# EAGLE design auto_leg_part (EAGLE 9.2.2)
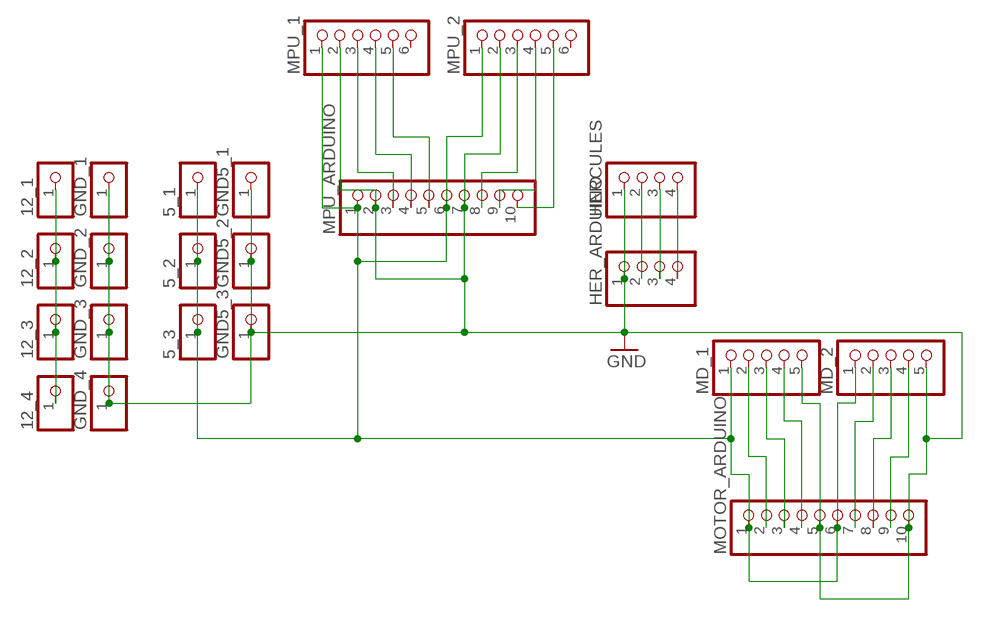
[diagram p0: schematic, sheet 1]

## Parts
5_1  PINHD-1X1  [1X01]
5_2  PINHD-1X1  [1X01]
5_3  PINHD-1X1  [1X01]
12_1  PINHD-1X1  [1X01]
12_2  PINHD-1X1  [1X01]
12_3  PINHD-1X1  [1X01]
12_4  PINHD-1X1  [1X01]
GND5_1  PINHD-1X1  [1X01]
GND5_2  PINHD-1X1  [1X01]
GND5_3  PINHD-1X1  [1X01]
GND_1  PINHD-1X1  [1X01]
GND_2  PINHD-1X1  [1X01]
GND_3  PINHD-1X1  [1X01]
GND_4  PINHD-1X1  [1X01]
HER_ARDUINO  PINHD-1X4  [1X04]
HERCULES  PINHD-1X4  [1X04]
MD_1  PINHD-1X5  [1X05]
MD_2  PINHD-1X5  [1X05]
MOTOR_ARDUINO  PINHD-1X10  [1X10]
MPU_1  PINHD-1X6  [1X06]
MPU_2  PINHD-1X6  [1X06]
MPU_ARDUINO  PINHD-1X10  [1X10]

## Nets
GND: GND5_1.1 GND5_2.1 GND5_3.1 GND_1.1 GND_2.1 GND_3.1 GND_4.1 HER_ARDUINO.1 HERCULES.1 MD_1.5 MD_2.5 MOTOR_ARDUINO.5 MOTOR_ARDUINO.10 MPU_1.2 MPU_2.2 MPU_ARDUINO.2 MPU_ARDUINO.7
N$3: 12_1.1 12_2.1 12_3.1 12_4.1
N$5: 5_1.1 5_2.1 5_3.1 MD_1.1 MD_2.1 MOTOR_ARDUINO.1 MOTOR_ARDUINO.6 MPU_1.1 MPU_2.1 MPU_ARDUINO.1 MPU_ARDUINO.6
N$7: MPU_1.3 MPU_ARDUINO.3
N$8: MPU_1.4 MPU_ARDUINO.4
N$9: MPU_1.5 MPU_ARDUINO.5
N$12: MPU_2.3 MPU_ARDUINO.8
N$13: MPU_2.4 MPU_ARDUINO.9
N$14: MPU_2.5 MPU_ARDUINO.10
N$16: MD_1.4 MOTOR_ARDUINO.4
N$17: MD_1.3 MOTOR_ARDUINO.3
N$18: MD_1.2 MOTOR_ARDUINO.2
N$21: MD_2.2 MOTOR_ARDUINO.7
N$22: MD_2.3 MOTOR_ARDUINO.8
N$23: MD_2.4 MOTOR_ARDUINO.9
N$26: HER_ARDUINO.2 HERCULES.2
N$27: HER_ARDUINO.3 HERCULES.3
N$28: HER_ARDUINO.4 HERCULES.4
Unconnected: MPU_1.6 MPU_2.6

## Library data of the parts
5_1-5_3 12_1-12_4 GND5_1-GND5_3 GND_1-GND_4 = pinhead:PINHD-1X1: PIN HEADER
HER_ARDUINO HERCULES = pinhead:PINHD-1X4: PIN HEADER
MD_1 MD_2 = pinhead:PINHD-1X5: PIN HEADER
MOTOR_ARDUINO MPU_ARDUINO = pinhead:PINHD-1X10: PIN HEADER
MPU_1 MPU_2 = pinhead:PINHD-1X6: PIN HEADER

## Board
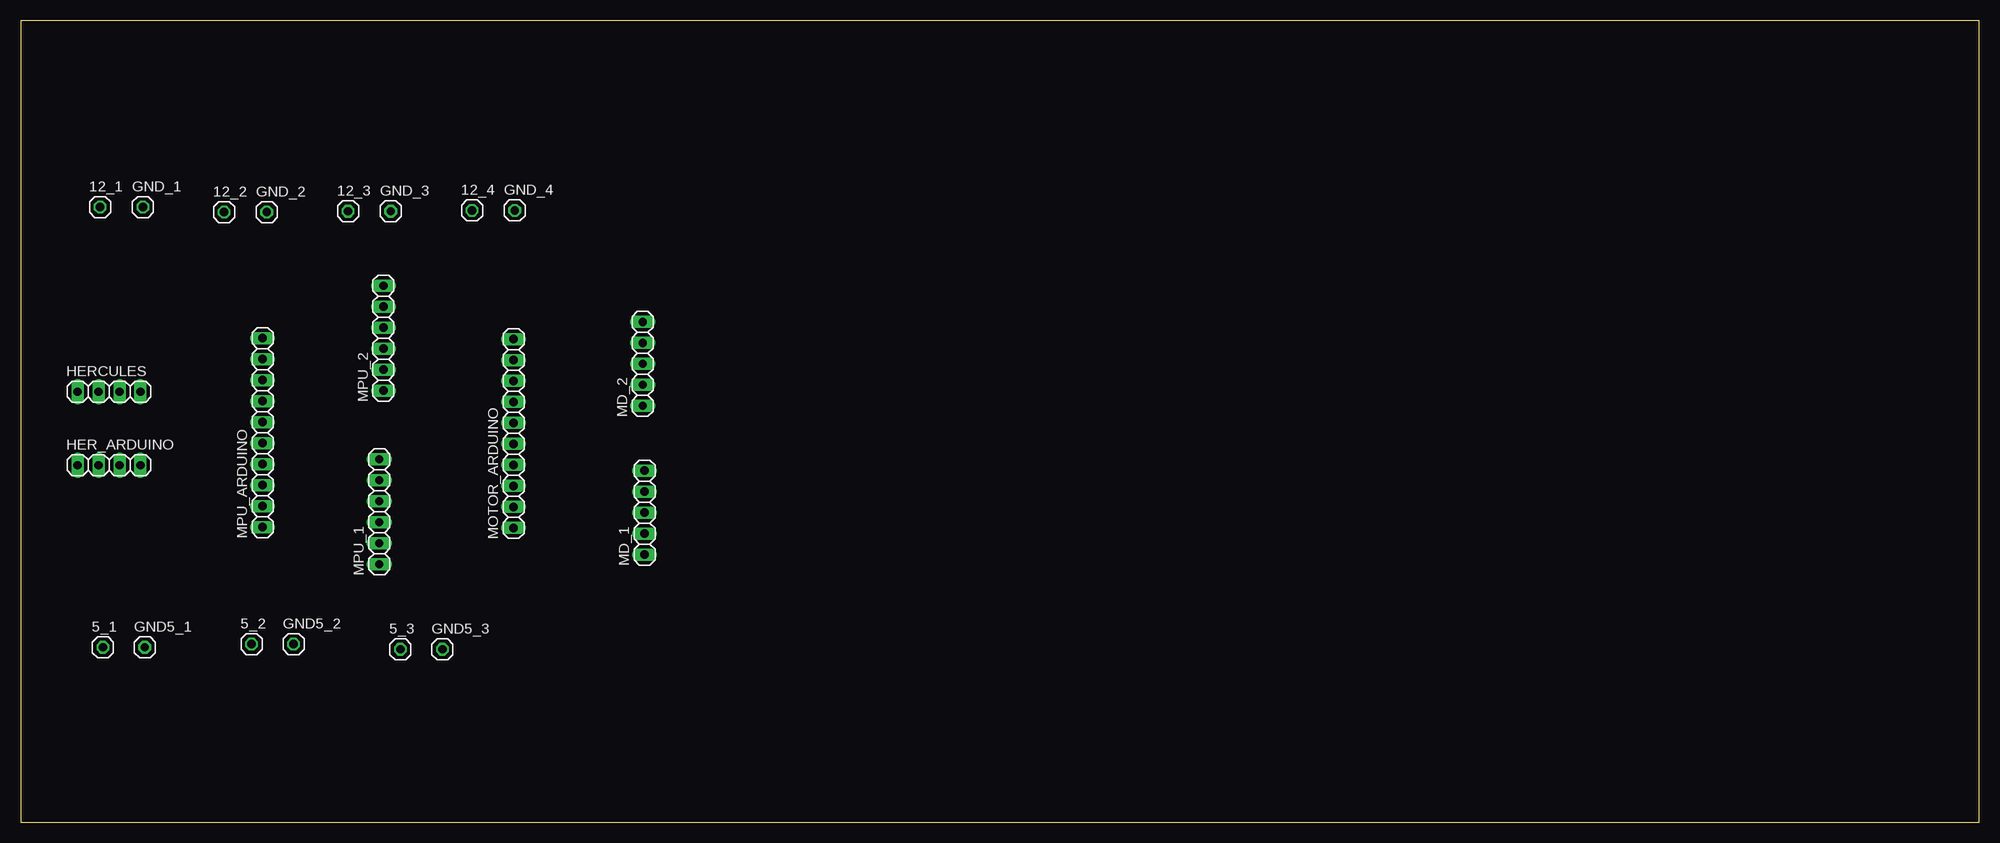
[diagram p1: board, top side]
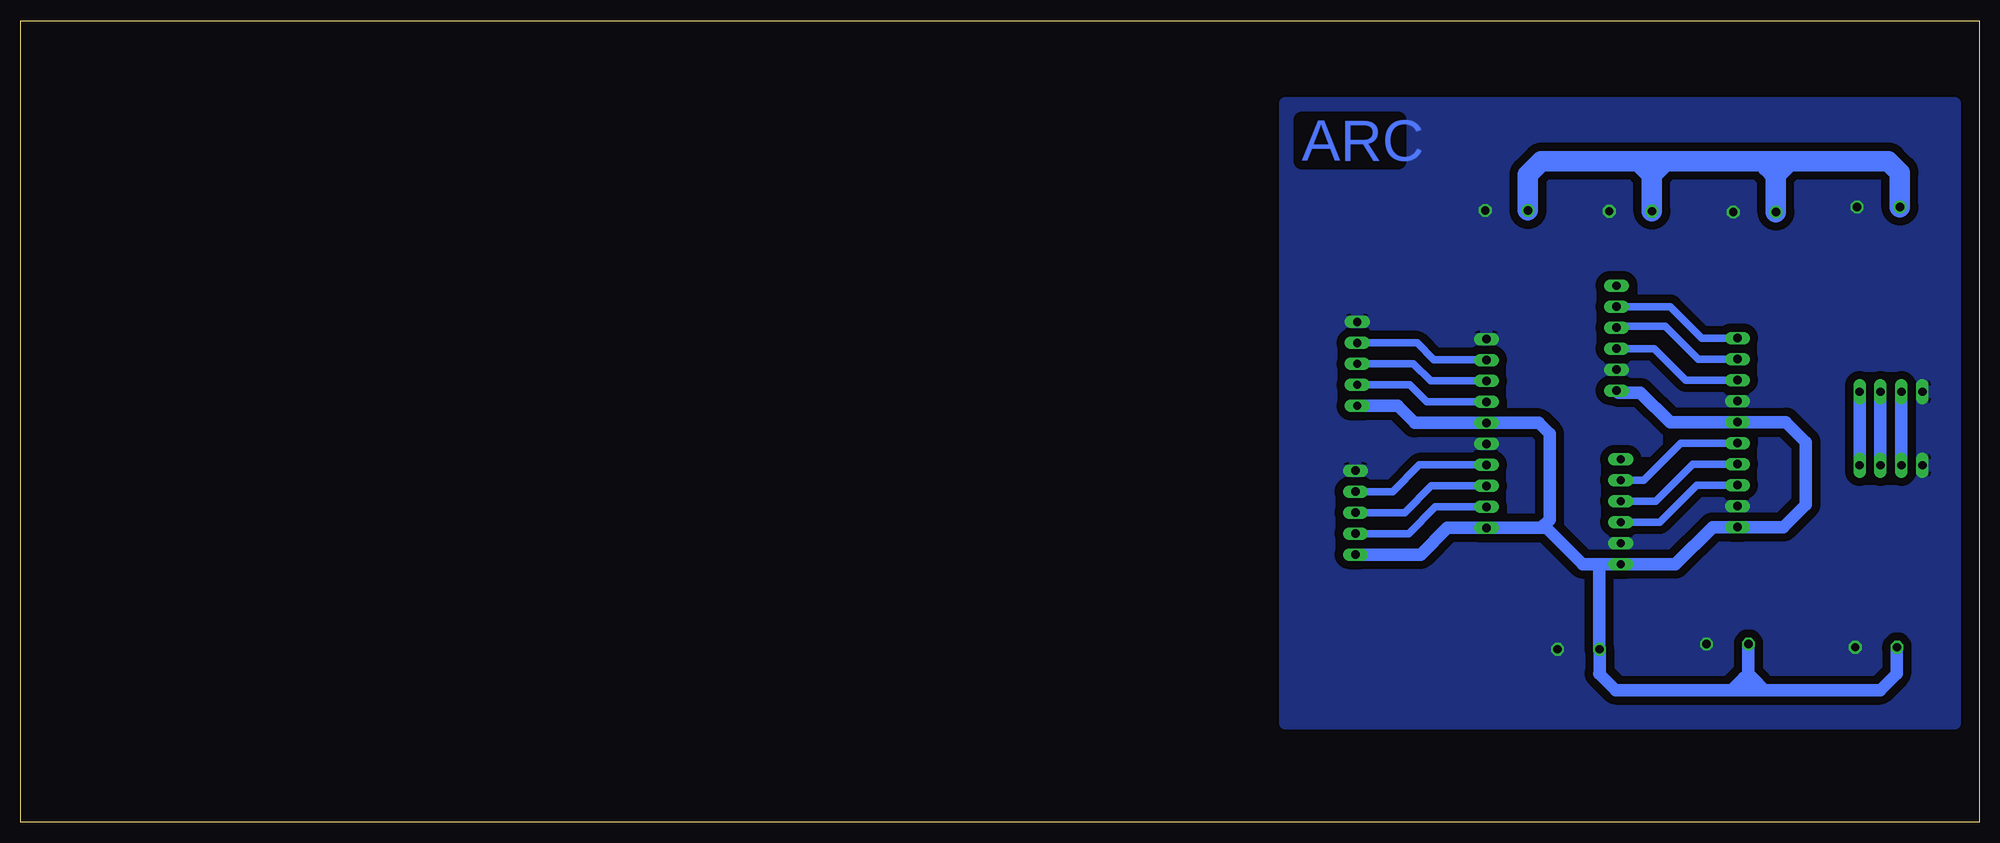
[diagram p2: board, bottom side, seen from below]

Size 237 x 97 mm. Coordinates in mm from the lower left corner, seen from the top.
Outline: 0,0 237,0 237,97 0,97 0,0
Copper layers (1*16): Top 0.035mm / dielectric 1.5mm / Bottom 0.035mm
Design rules "default": minimum track width 6mil, minimum drill 0.35mm, track to track 6mil, track to pad 6mil, pad to pad 6mil, via to via 6mil, smd to smd 6mil, copper to edge 40mil, drill to drill 6mil, minimum pad ring 10mil, minimum via ring 8mil, stop-mask expansion 4mil, vias tented up to drill 0mil, thermal gap 10mil

### Footprints (pad centres in the part's own frame; a part is rotated, then mirrored left to right if it is on the bottom)
1X01 = drill 1.016 octagon: 1 0,0
1X04 = drill 1.016 long: 1 -3.81,0; 2 -1.27,0; 3 1.27,0; 4 3.81,0
1X05 = drill 1.016 long: 1 -5.08,0; 2 -2.54,0; 3 0,0; 4 2.54,0; 5 5.08,0
1X10 = drill 1.016 long: 1 -11.43,0; 2 -8.89,0; 3 -6.35,0; 4 -3.81,0; 5 -1.27,0; 6 1.27,0; 7 3.81,0; 8 6.35,0; 9 8.89,0; 10 11.43,0
1X06 = drill 1.016 long: 1 -6.35,0; 2 -3.81,0; 3 -1.27,0; 4 1.27,0; 5 3.81,0; 6 6.35,0

### Placement (x,y rotation side)
5_1  9.94,21.18 0 top
5_2  27.94,21.56 0 top
5_3  45.94,20.94 0 top
12_1  9.62,74.45 0 top
12_2  24.62,73.83 0 top
12_3  39.62,73.94 0 top
12_4  54.62,74.05 0 top
GND5_1  15.02,21.18 0 top
GND5_2  33.02,21.56 0 top
GND5_3  51.02,20.94 0 top
GND_1  14.78,74.45 0 top
GND_2  29.78,73.83 0 top
GND_3  44.78,73.94 0 top
GND_4  59.78,74.05 0 top
HER_ARDUINO  10.69,43.21 0 top
HERCULES  10.69,52.1 0 top
MD_1  75.49,37.48 90 top
MD_2  75.27,55.48 90 top
MOTOR_ARDUINO  59.65,47.05 90 top
MPU_1  43.39,37.58 90 top
MPU_2  43.9,58.58 90 top
MPU_ARDUINO  29.28,47.15 90 top

### Tracks (layer width: path | path; a pad name or v marks a point on that pad's centre or on a via)
GND
  pour Bottom (isolate 1): 3,87 84,87 84,12 3,12
N$3
  Bottom 1.5: 24.62,78.38 25.38,78.38 26,79 | 42,80 40,78
  Bottom 2.5: 12_1.1 9.62,78.62 11,80 23,80 | 23,80 38,80 | 38,80 42,80 53,80 54.62,78.38 12_4.1 | 12_2.1 24.62,78.38 23,80 | 12_3.1 39.62,78.38 38,80
N$5
  Bottom 1.5: 5_1.1 10,21.12 10,18 12,16 26,16 | 30,16 44,16 46,18 45.94,18.06 5_3.1 46,21 46,31.23 | 30,16 26,16 | 5_2.1 27.94,17.94 27.5,17.5 | 27.5,17.5 26,16 | 27.5,17.5 28.5,17.5 30,16 | 53,35.62 MOTOR_ARDUINO.1 64.38,35.62 67.6,32.4 MD_1.1 | 53,35.62 52,36.62 52,47 53.32,48.32 MOTOR_ARDUINO.6 68.32,48.32 70.4,50.4 MD_2.1 | MPU_2.1 43.67,52 41,52 37.42,48.42 MPU_ARDUINO.6 23.42,48.42 21,46 21,38.44 23.72,35.72 MPU_ARDUINO.1 32.28,35.72 36.77,31.23 MPU_1.1 46,31.23 | 53,35.62 52.39,35.62 48,31.23 46,31.23
N$7
  Bottom 0.9: MPU_ARDUINO.3 34.2,40.8 38.69,36.31 MPU_1.3
N$8
  Bottom 0.9: MPU_ARDUINO.4 34.66,43.34 39.15,38.85 MPU_1.4
N$9
  Bottom 0.9: MPU_ARDUINO.5 36.12,45.88 40.61,41.39 MPU_1.5
N$12
  Bottom 0.9: MPU_ARDUINO.8 35.5,53.5 39.31,57.31 MPU_2.3
N$13
  Bottom 0.9: MPU_ARDUINO.9 34.04,56.04 38,60 43.75,60 MPU_2.4
N$14
  Bottom 0.9: MPU_ARDUINO.10 33.58,58.58 37.39,62.39 MPU_2.5
N$16
  Bottom 0.9: MOTOR_ARDUINO.4 67.76,43.24 71,40 75.47,40 MD_1.4
N$17
  Bottom 0.9: MOTOR_ARDUINO.3 66.3,40.7 69.52,37.48 MD_1.3
N$18
  Bottom 0.9: MOTOR_ARDUINO.2 65.84,38.16 69.06,34.94 MD_1.2
N$21
  Bottom 0.9: MOTOR_ARDUINO.7 66.86,50.86 68.94,52.94 MD_2.2
N$22
  Bottom 0.9: MOTOR_ARDUINO.8 66.4,53.4 68.48,55.48 MD_2.3
N$23
  Bottom 0.9: MOTOR_ARDUINO.9 59.71,56 66,56 68.02,58.02 MD_2.4
N$26
  Bottom 1.5: HERCULES.2 HER_ARDUINO.2
N$27
  Bottom 1.5: HERCULES.3 HER_ARDUINO.3
N$28
  Bottom 1.5: HER_ARDUINO.4 HERCULES.4

### Text on the board
Bottom: ARC